# Altium schematic sheet Main.SchDoc
size A4
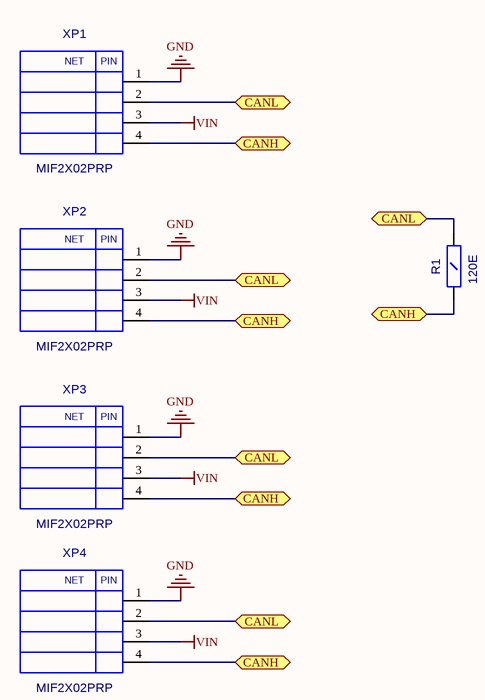
[diagram p0: Main.SchDoc]

## Parts
R1  120E  [RC1206]
XP1  MIF2X02PRP  [MIF2X02PRP]
XP2  MIF2X02PRP  [MIF2X02PRP]
XP3  MIF2X02PRP  [MIF2X02PRP]
XP4  MIF2X02PRP  [MIF2X02PRP]

## Ports
CANH, CANL

## Nets
GND: XP1.1 XP2.1 XP3.1 XP4.1
VIN: XP1.3 XP2.3 XP3.3 XP4.3
CANH: R1.1(A) XP1.4 XP2.4 XP3.4 XP4.4 ; port CANH
CANL: R1.2(B) XP1.2 XP2.2 XP3.2 XP4.2 ; port CANL

## Notes on the sheet
- (in symbol MIF2X02PRP) NET; PIN

## Library data of the parts
R1 = RC1206: Value: 120E
XP1-XP4 = MIF2X02PRP: Value: *